# EAGLE design auxboxshield1.6 (EAGLE 6.5.0)
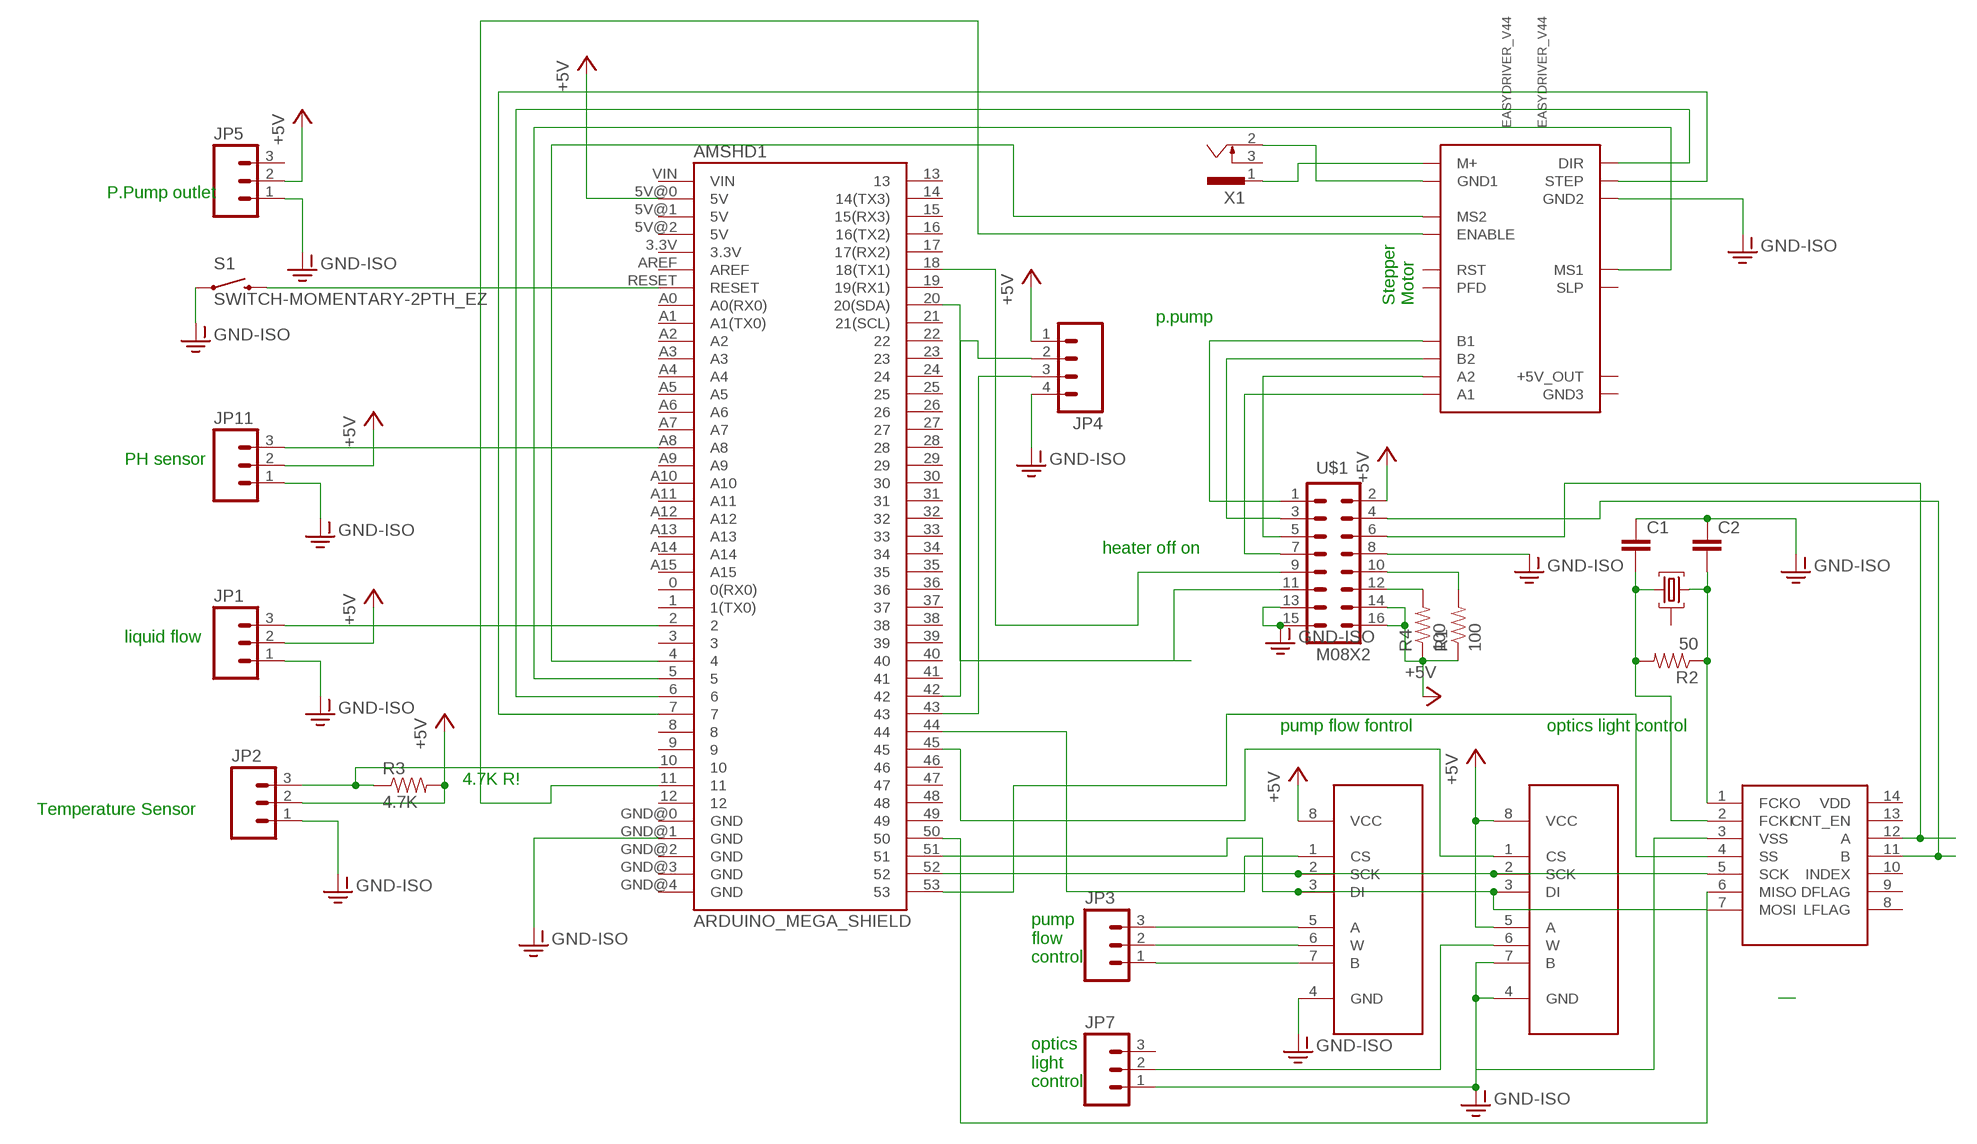
[diagram p0: schematic, sheet 1]

## Parts
AMSHD1  ARDUINO_MEGA_SHIELD  [ARDUINO_MEGA_SHIELD]
C1  0.1UF-50V-20%(PTH)KIT-EZ  [CAP-PTH-SMALL-KIT]
C2  0.1UF-50V-20%(PTH)KIT-EZ  [CAP-PTH-SMALL-KIT]
EASYDRIVER_V44  EASYDRIVER_V44  [EASYDRIVER_V44]
JP1  M03POLAR  [MOLEX-1X3]
JP2  M03POLAR  [MOLEX-1X3]
JP3  M03POLAR  [MOLEX-1X3]
JP4  M04POLAR  [MOLEX-1X4]
JP5  M03POLAR  [MOLEX-1X3]
JP7  M03POLAR  [MOLEX-1X3]
JP11  M03POLAR  [MOLEX-1X3]
QF1  21M30AUM5  [UM5]
R1  100  10OHM-1/4W-5%(PTH)  [AXIAL-0.3]
R2  50  10OHM-1/4W-5%(PTH)  [AXIAL-0.3]
R3  4.7K  10OHM-1/4W-5%(PTH)  [AXIAL-0.3]
R4  100  10OHM-1/4W-5%(PTH)  [AXIAL-0.3]
S1  SWITCH-MOMENTARY-2PTH_EZ  [TACTILE-PTH-EZ]
U1  MCP41XXXDIL  [DIL-08]
U2  MCP41XXXDIL  [DIL-08]
U$1  M08X2  [2X8]
U$2  LS7366R  [SO014]
X1  SCD-014A  [SCD-014-A]

## Nets
+5V: AMSHD1.5V@0(5V) JP1.2 JP2.2 JP4.1 JP5.2 JP11.2 R1.P$1 R3.P$2 R4.P$1 U1.5(A) U1.8(VCC) U2.8(VCC) U$1.14 U$1.16
GND-ISO: AMSHD1.GND@1(GND) C1.1 C2.1 EASYDRIVER_V44.GND2 JP1.1 JP2.1 JP4.4 JP5.1 JP7.1 JP11.1 S1.1 U1.4(GND) U1.7(B) U2.4(GND) U$1.8 U$1.13 U$1.15 U$2.3(VSS)
N$1: EASYDRIVER_V44.M+ X1.1
N$2: AMSHD1.11 EASYDRIVER_V44.ENABLE
N$3: AMSHD1.18(18(TX1)) U$1.9
N$4: R1.P$2 U$1.10
N$5: U$1.4 U$2.11(B)
N$6: EASYDRIVER_V44.GND1 X1.2
N$7: EASYDRIVER_V44.A1 U$1.7
N$8: AMSHD1.43 JP4.3
N$9: AMSHD1.RESET S1.3
N$10: AMSHD1.44 U2.1(CS)
N$11: EASYDRIVER_V44.A2 U$1.5
N$12: C1.2 QF1.1 R2.P$2 U$2.2(FCKI)
N$13: AMSHD1.5 EASYDRIVER_V44.MS1
N$14: AMSHD1.45 U1.1(CS)
N$15: AMSHD1.A8 JP11.3
N$16: AMSHD1.4 EASYDRIVER_V44.MS2
N$17: AMSHD1.52 U1.2(SCK) U2.2(SCK) U$2.5(SCK)
N$18: AMSHD1.20(20(SDA))
N$19: U$1.11
N$20: AMSHD1.51 U1.3(DI) U2.3(DI) U$2.7(MOSI)
N$21: JP3.3 U2.5(A)
N$22: AMSHD1.42 JP4.2
N$24: JP3.2 U2.6(W)
N$25: C2.2 QF1.3 R2.P$1 U$2.1(FCKO)
N$26: AMSHD1.10 JP2.3 R3.P$1
N$27: EASYDRIVER_V44.B2 U$1.3
N$28: AMSHD1.2 JP1.3
N$29: AMSHD1.6 EASYDRIVER_V44.DIR
N$30: AMSHD1.7 EASYDRIVER_V44.STEP
N$31: EASYDRIVER_V44.B1 U$1.1
N$32: JP3.1 U2.7(B)
N$33: R4.P$2 U$1.12
N$34: U$1.6 U$2.12(A)
N$35: JP7.2 U1.6(W)
N$36: AMSHD1.53 U$2.4(SS)
N$37: AMSHD1.50 U$2.6(MISO)
Unconnected: AMSHD1.0(0(RX0)) AMSHD1.1(1(TX0)) AMSHD1.3 AMSHD1.3.3V AMSHD1.5V@1(5V) AMSHD1.5V@2(5V) AMSHD1.8 AMSHD1.9 AMSHD1.12 AMSHD1.13 AMSHD1.14(14(TX3)) AMSHD1.15(15(RX3)) AMSHD1.16(16(TX2)) AMSHD1.17(17(RX2)) AMSHD1.19(19(RX1)) AMSHD1.21(21(SCL)) AMSHD1.22 AMSHD1.23 AMSHD1.24 AMSHD1.25 AMSHD1.26 AMSHD1.27 AMSHD1.28 AMSHD1.29 AMSHD1.30 AMSHD1.31 AMSHD1.32 AMSHD1.33 AMSHD1.34 AMSHD1.35 AMSHD1.36 AMSHD1.37 AMSHD1.38 AMSHD1.39 AMSHD1.40 AMSHD1.41 AMSHD1.46 AMSHD1.47 AMSHD1.48 AMSHD1.49 AMSHD1.A0(A0(RX0)) AMSHD1.A1(A1(TX0)) AMSHD1.A2 AMSHD1.A3 AMSHD1.A4 AMSHD1.A5 AMSHD1.A6 AMSHD1.A7 AMSHD1.A9 AMSHD1.A10 AMSHD1.A11 AMSHD1.A12 AMSHD1.A13 AMSHD1.A14 AMSHD1.A15 AMSHD1.AREF AMSHD1.GND@0(GND) AMSHD1.GND@2(GND) AMSHD1.GND@3(GND) AMSHD1.GND@4(GND) AMSHD1.VIN EASYDRIVER_V44.GND3 EASYDRIVER_V44.P$11(+5V_OUT) EASYDRIVER_V44.PFD EASYDRIVER_V44.RST EASYDRIVER_V44.SLEEP(SLP) JP5.3 JP7.3 QF1.2 U$1.2 U$2.8(LFLAG) U$2.9(DFLAG) U$2.10(INDEX) U$2.13(CNT_EN) U$2.14(VDD) X1.3

## Notes on the sheet
- P.Pump outlet
- Stepper
  Motor
- p.pump
- PH sensor
- heater off on
- liquid flow
- pump flow fontrol | optics light control
- 4.7K R!
- Temperature Sensor
- pump 
  flow
  control
- optics
  light 
  control

## Library data of the parts
AMSHD1 = SparkFun-Boards:ARDUINO_MEGA_SHIELD
C1 C2 = SparkFun-Capacitors:0.1UF-50V-20%(PTH): CAP-08370; PROD_ID: CAP-08370
EASYDRIVER_V44 = EasyDriver:EASYDRIVER_V44: EasyDriver version 4.4 - http://www.schmalzhaus.com/EasyDriver
JP1-JP3 JP5 JP7 JP11 = SparkFun-Connectors:M03: Header 3 Standard 3-pin 0.1" header. Use with straight break away headers (SKU : PRT-00116), right angle break away headers (PRT-00553), swiss pins (PRT-00743), machine pins (PRT-00117), and female headers (PRT-00115). Molex polarized connector foot print use with SKU : PRT-08232 with associated crimp pins and housings.
JP4 = SparkFun-Connectors:M04: Header 4 Standard 4-pin 0.1" header. Use with straight break away headers (SKU : PRT-00116), right angle break away headers (PRT-00553), swiss pins (PRT-00743), machine pins (PRT-00117), and female headers (PRT-00115). Molex polarized connector foot print use with SKU : PRT-08231 with associated crimp pins and housings. 1MM SMD Version SKU: PRT-10208
QF1 = crystal:21M*A: Monolithic Crystal Filters Source: www.vanlong.com; OC_FARNELL: unknown; OC_NEWARK: unknown
R1-R4 = SparkFun-Resistors:10OHM-1/4W-5%(PTH): RES-10698; PROD_ID: RES-10698; VALUE: 10
S1 = SparkFun-Electromechanical:SWITCH-MOMENTARY-2: Various NO switches- pushbuttons, reed, etc
U1 U2 = SparkFun-AnalogIC:MCP41XXX: SPI controlled single digital potentiometer by Microchip PID: COM-10613
U$1 = SparkFun-Connectors:M08X2: .1" headers, two rows of 8 each
U$2 = SparkFun-DigitalIC:LS7366R
X1 = con-shiua-chyuan:SCD-014A: Power Jack 2.5mm; OC_FARNELL: unknown; OC_NEWARK: unknown

## Board
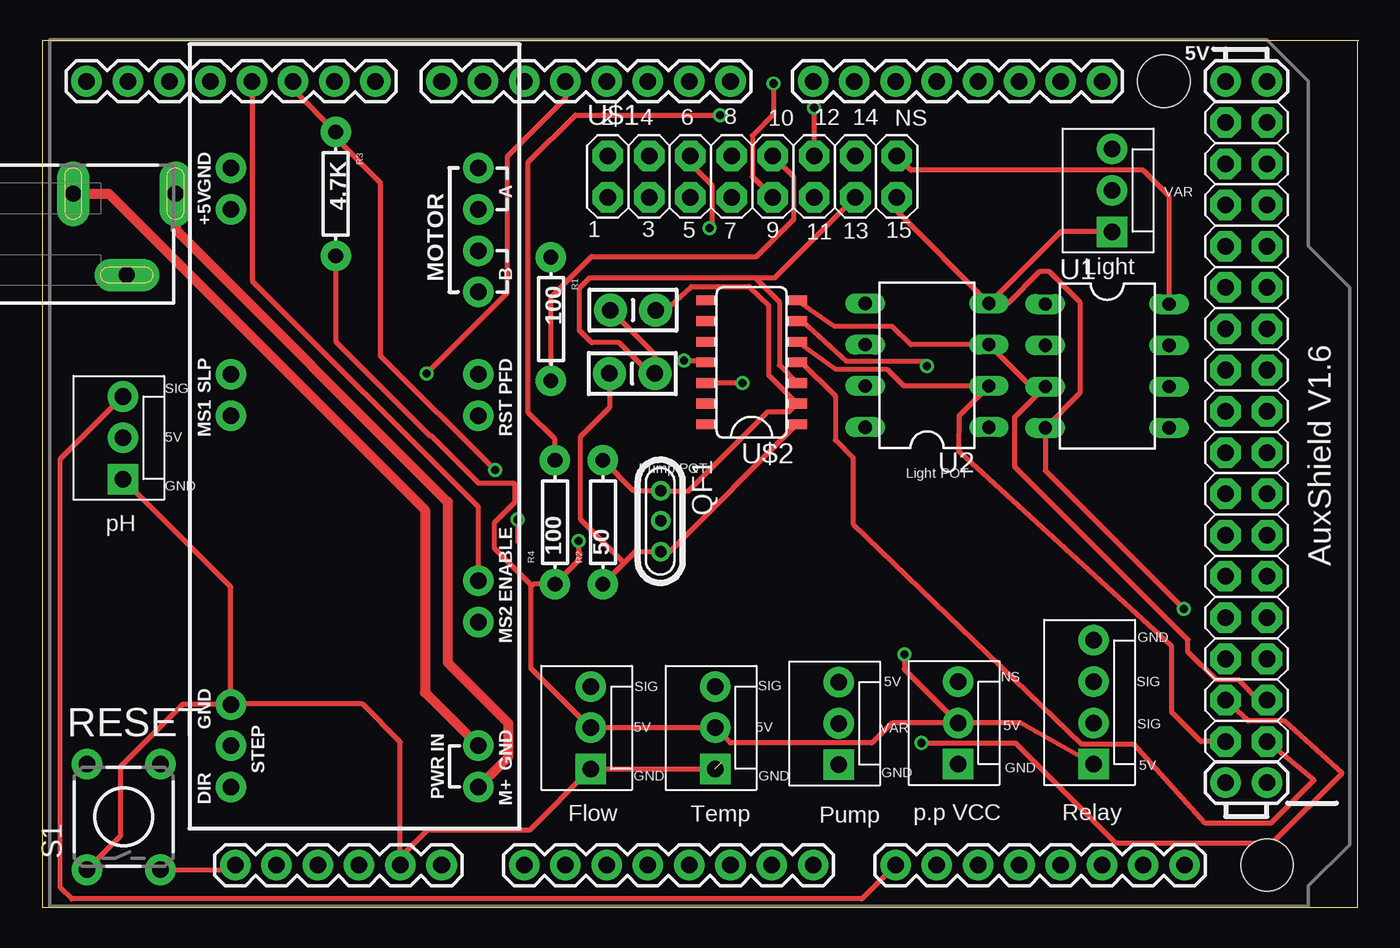
[diagram p1: board, top side]
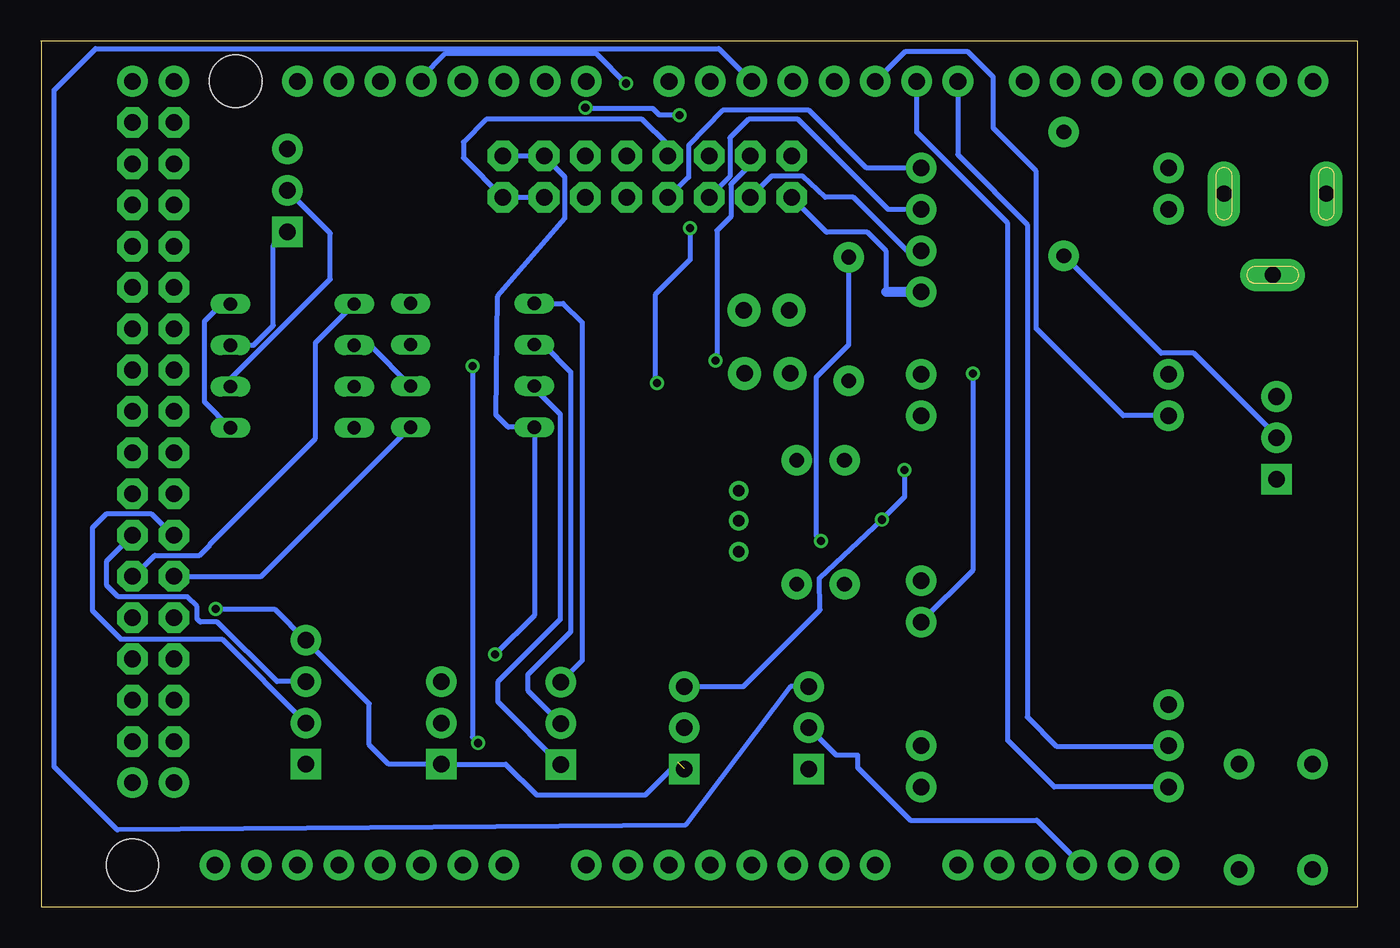
[diagram p2: board, bottom side, seen from below]

Size 81.03 x 53.34 mm. Coordinates in mm from the lower left corner, seen from the top.
Outline: 80.95,53.33 80.95,0 0,0 0,53.33
Outline: 81.03,53.34 0,53.34
Copper layers (1*16): Top 0.0356mm / dielectric 1.5011mm / Bottom 0.0356mm
Design rules "LaenPCBOrder (1)": minimum track width 6mil, minimum drill 13mil, track to track 6mil, track to pad 6mil, pad to pad 6mil, via to via 6mil, smd to smd 6mil, copper to edge 15mil, drill to drill 6mil, minimum pad ring 7mil, minimum via ring 7mil, stop-mask expansion 3mil, vias tented up to drill 0mil, thermal gap 10mil

### Footprints (pad centres in the part's own frame; a part is rotated, then mirrored left to right if it is on the bottom)
ARDUINO_MEGA_SHIELD = drill 1.016 pad 1.88: 0 19.05,27.94; 1 16.51,27.94; 2 13.97,27.94; 3 11.43,27.94; 3.3V -8.89,-20.32; 4 8.89,27.94; 5 6.35,27.94; 5V@0 -6.35,-20.32; 5V@1 49.53,27.94; 5V@2 52.07,27.94; 6 3.81,27.94; 7 1.27,27.94; 8 -2.794,27.94; 9 -5.334,27.94; 10 -7.874,27.94; 11 -10.414,27.94; 12 -12.954,27.94; 13 -15.494,27.94; 14 24.13,27.94; 15 26.67,27.94; 16 29.21,27.94; 17 31.75,27.94; 18 34.29,27.94; 19 36.83,27.94; 20 39.37,27.94; 21 41.91,27.94; A0 6.35,-20.32; A1 8.89,-20.32; A2 11.43,-20.32; A3 13.97,-20.32; A4 16.51,-20.32; A5 19.05,-20.32; A6 21.59,-20.32; A7 24.13,-20.32; A8 29.21,-20.32; A9 31.75,-20.32; A10 34.29,-20.32; A11 36.83,-20.32; A12 39.37,-20.32; A13 41.91,-20.32; A14 44.45,-20.32; A15 46.99,-20.32; AREF -20.574,27.94; GND@0 -3.81,-20.32; GND@1 -1.27,-20.32; GND@2 49.53,-15.24; GND@3 52.07,-15.24; GND@4 -18.034,27.94; RESET -11.43,-20.32; VIN 1.27,-20.32 | drill 1.016 pad 1.88 octagon: 22 49.53,25.4; 23 52.07,25.4; 24 49.53,22.86; 25 52.07,22.86; 26 49.53,20.32; 27 52.07,20.32; 28 49.53,17.78; 29 52.07,17.78; 30 49.53,15.24; 31 52.07,15.24; 32 49.53,12.7; 33 52.07,12.7; 34 49.53,10.16; 35 52.07,10.16; 36 49.53,7.62; 37 52.07,7.62; 38 49.53,5.08; 39 52.07,5.08; 40 49.53,2.54; 41 52.07,2.54; 42 49.53,0; 43 52.07,0; 44 49.53,-2.54; 45 52.07,-2.54; 46 49.53,-5.08; 47 52.07,-5.08; 48 49.53,-7.62; 49 52.07,-7.62; 50 49.53,-10.16; 51 52.07,-10.16; 52 49.53,-12.7; 53 52.07,-12.7 | hole 3.2: 45.72,27.94; 52.07,-20.32
CAP-PTH-SMALL-KIT = drill 1.016 pad 2.032: 1 -1.397,0; 2 1.397,0
EASYDRIVER_V44 = drill 1.016 pad 1.88: A1 -16.51,7.62; A2 -13.97,7.62; B1 -8.89,7.62; B2 -11.43,7.62; DIR 21.59,-7.62; ENABLE 8.89,7.62; GND1 19.05,7.62; GND2 16.51,-7.62; GND3 -16.51,-7.62; M+ 21.59,7.62; MS1 -1.27,-7.62; MS2 11.43,7.62; P$11 -13.97,-7.62; PFD -3.81,7.62; RST -1.27,7.62; SLEEP -3.81,-7.62; STEP 19.05,-7.62
MOLEX-1X3 = drill 1.016 pad 1.88 square: 1 0,0 | drill 1.016 pad 1.88: 2 2.54,0; 3 5.08,0
MOLEX-1X4 = drill 1.016 pad 1.88 square: 1 0,0 | drill 1.016 pad 1.88: 2 2.54,0; 3 5.08,0; 4 7.62,0
UM5 = drill 0.7 pad 1.2: 1 -1.875,0; 2 -0.027,0; 3 1.875,0
AXIAL-0.3 = drill 0.9 pad 1.88: P$1 -3.81,0; P$2 3.81,0
TACTILE-PTH-EZ = drill 1.016 pad 1.88: 1 -3.251,2.261; 2 3.251,2.261; 3 -3.251,-2.261; 4 3.251,-2.261
DIL-08 = drill 0.813 long: 1 -3.81,-3.81; 2 -1.27,-3.81; 3 1.27,-3.81; 4 3.81,-3.81; 5 3.81,3.81; 6 1.27,3.81; 7 -1.27,3.81; 8 -3.81,3.81
2X8 = drill 1.016 pad 1.88 octagon: 1 0,0; 2 0,2.54; 3 2.54,0; 4 2.54,2.54; 5 5.08,0; 6 5.08,2.54; 7 7.62,0; 8 7.62,2.54; 9 10.16,0; 10 10.16,2.54; 11 12.7,0; 12 12.7,2.54; 13 15.24,0; 14 15.24,2.54; 15 17.78,0; 16 17.78,2.54
SO014 = smd 0.6 x 1.2: 1 -3.175,-2.8; 2 -1.905,-2.8; 3 -0.635,-2.8; 4 0.635,-2.8; 5 1.905,-2.8; 6 3.175,-2.8; 7 4.445,-2.8; 8 4.445,2.8; 9 3.175,2.8; 10 1.905,2.8; 11 0.635,2.8; 12 -0.635,2.8; 13 -1.905,2.8; 14 -3.175,2.8
SCD-014-A = drill 1 pad 2 long: 1 -2.5,13.8; 2 -2.5,7.5; 3 2.5,10.8

### Placement (x,y rotation side)
AMSHD1  23.3,22.9 0 top
C1  36.35,36.75 0 top
C2  36.3,32.85 180 top
EASYDRIVER_V44  19.21,28.98 270 top
JP1  33.75,8.5 90 top
JP2  41.4,8.5 90 top
JP3  49.01,8.77 90 top
JP4  64.7,8.8 90 top
JP5  56.35,8.8 90 top
JP7  65.84,41.58 90 top
JP11  4.95,26.35 90 top
QF1  38.05,23.75 270 top
R1  31.3,36.2 270 top
R2  34.5,23.7 90 top
R3  18.05,43.9 270 top
R4  31.55,23.7 90 top
S1  5,5.55 90 top
U1  65.53,33.31 270 top
U2  54.45,33.35 90 top
U$1  34.8,43.7 0 top
U$2  43.65,32.9 90 top
X1  -5.61,41.42 270 top

### Tracks (layer width: path | path; a pad name or v marks a point on that pad's centre or on a via)
+5V  (via drill 0.5 pad 0.25)
  Top 0.305: R3.P$2 18.05,34.8 23.85,29 23.95,29 26.85,26.1 29.05,26.1 29.05,24.9 27.8,23.65 27.8,22.1 30.05,19.85 30.05,19.7 | 30.05,19.7 30.05,14.74 JP1.2 JP2.2 42.34,10.1 51.05,10.1 52.29,11.34 JP5.2 | JP4.1 60.19,11.35 JP5.2 | 30.05,19.7 30.24,19.89 R4.P$1 33,21.34 v33,22.55 | v53.05,15.55 53.05,14.64 JP5.2 | U1.8 69.34,43.76 67.75,45.35 53.47,45.35 U$1.16
  Bottom 0.305: AMSHD1.5V@0 19.72,5.35 27.5,5.35 30.75,8.6 30.75,9.35 32.06,9.35 JP1.2 | JP11.2 4.95,29 10.05,34.1 12.06,34.1 R3.P$2 | U1.8 69.88,37.12 70.95,36.05 70.95,31.11 U1.5 | U$1.16 U$1.14 48.75,44.95 48.75,42.4 52.9,37.6 53,30.3 52.24,29.54 U2.8 50.64,17.96 v53.05,15.55 | R1.P$1 31.3,34.6 33.3,32.6 33.3,22.85 v33,22.55
GND-ISO  (via drill 0.5 pad 0.25)  (1 unrouted)
  Top 0.305: EASYDRIVER_V44.GND2 11.62,12.5 19.7,12.5 22.03,10.17 AMSHD1.GND@1 22.03,3.08 23.7,4.75 30,4.75 JP1.1 JP2.1 | EASYDRIVER_V44.GND2 11.59,19.71 JP11.1 | EASYDRIVER_V44.GND2 8.62,12.47 4.8,8.65 4.8,4.36 S1.1 | JP7.1 62.67,41.58 U2.4 | U$1.15 52.58,42.84 U2.4 | U2.4 59.41,37.16 61.4,39.15 61.95,39.15 63.85,37.25 63.85,31.63 U1.4 61.73,26.88 v70.25,18.35 | C1.1 37.7,34.01 C2.1 37.4,32.85 35.5,34.75 33.8,34.75 33.05,35.5 33.05,38.1 33.7,38.75 43.85,38.75 | 43.85,38.75 45.35,37.25 45.35,33.37 U$2.3 | 43.85,38.75 45.09,38.75 U$1.13
  Bottom 0.305: U1.7 67.92,34.59 66.7,35.8 66.7,40.72 JP7.1 | 41.8,8.9 43.8,6.9 50.5,6.9 52.4,8.8 JP5.1 59.6,8.8 60.8,10 60.8,12.52 JP4.4 66.63,18.35 v70.25,18.35 | U$1.8 42.42,46.92 44,48.5 53.6,48.5 55,47.1 55,46.12 U$1.15 U$1.13
N$1
  Top 0.61: X1.1 8.19,41.71 24.95,24.95 24.95,15.05 28.65,11.35 28.65,9.21 EASYDRIVER_V44.M+
N$2
  Top 0.305: EASYDRIVER_V44.ENABLE 26.83,24.62 12.95,38.5 12.95,50.78 AMSHD1.11
N$3  (via drill 0.5 pad 0.25)
  Top 0.305: v45,50.7 45,48.8 43.7,47.5 43.7,44.96 U$1.9
  Bottom 0.305: AMSHD1.18 57.59,51.06 56.1,52.55 46.85,52.55 v45,50.7
N$4
  Top 0.305: R1.P$2 31.3,37.55 33.8,40.05 43.95,40.05 46.25,42.35 46.25,44.95 U$1.10
N$5  (via drill 0.5 pad 0.25)
  Top 0.305: v39.5,33.65 40.73,33.65 U$2.11
  Bottom 0.305: U$1.4 37.34,45.71 38.55,44.5 38.55,42.5 39.4,41.65 39.4,33.75 v39.5,33.65
N$6
  Top 0.61: X1.2 4.08,43.92 23.55,24.45 23.55,13.21 EASYDRIVER_V44.GND1
N$7
  Bottom 0.305: EASYDRIVER_V44.A1 30.19,45.49 33.75,49.05 39.05,49.05 41.15,46.9 41.15,44.92 U$1.7
N$8
  Bottom 0.305: JP4.3 66.48,13.88 70.15,17.55 71.2,17.55 71.4,17.75 71.4,18.5 72,19.1 76.25,19.1 76.95,19.8 76.95,21.32 AMSHD1.43
N$9
  Top 0.305: S1.3 11.59,2.3 AMSHD1.RESET
N$10
  Bottom 0.305: AMSHD1.44 67.44,20.36 U2.1
N$11
  Bottom 0.305: EASYDRIVER_V44.A2 28.85,42.95 34.4,48.5 37.45,48.5 38.6,47.35 38.6,44.98 U$1.5
N$12
  Top 0.305: R2.P$2 36.38,25.62 QF1.1 39.77,25.62 44.65,30.5 45.95,30.5 U$2.2 44.7,32.74 44.7,37.05 43.5,38.2 39.95,38.2 38.35,36.75 C1.2
N$13
  Bottom 0.305: EASYDRIVER_V44.MS1 14.4,30.25 19.75,35.6 19.75,45.3 22.4,47.95 22.4,51.1 23.95,52.65 27.84,52.65 AMSHD1.5
N$14
  Bottom 0.305: AMSHD1.45 75.29,20.36 74,21.65 71.25,21.65 70.6,22.3 70.6,22.35 64.1,28.85 64.1,34.75 U1.1
N$15
  Top 0.305: JP11.3 1.1,27.58 1.1,1.2 1.8,0.5 50.43,0.5 AMSHD1.A8
N$16  (via drill 0.5 pad 0.25)
  Top 0.305: AMSHD1.4 32.19,49.79 28.6,46.2 28.6,37.8 v23.65,32.85
  Bottom 0.305: v23.65,32.85 23.65,20.73 EASYDRIVER_V44.MS2
N$17
  Top 0.305: AMSHD1.52 71.3,10.2 69.5,12 69.5,16.05 56.4,28.05 56.42,30.25 U2.2 53.02,32.08 52,33.1 48.85,33.1 U$2.5
  Bottom 0.305: U1.2 60.76,34.59 U2.2
N$20
  Top 0.305: AMSHD1.51 74.86,12.74 73.65,14 72.25,14 70.5,15.7 70.5,16.45 59.85,27.1 59.85,30.17 U1.3 60.84,32.05 U2.3 53.43,34.62 52.3,35.75 48.74,35.75 U$2.7
N$21
  Bottom 0.305: U2.5 48.86,37.16 47.7,36 47.7,15.16 JP3.3
N$22
  Bottom 0.305: AMSHD1.42 72.9,22.9 74.2,24.2 77,24.2 77.85,23.35 77.85,18.25 76.1,16.5 69.86,16.5 JP4.2
N$24
  Bottom 0.305: U2.6 50.07,34.62 48.4,32.95 48.4,16.95 51.05,14.3 51.05,13.35 JP3.2
N$25
  Top 0.305: 35.8,21.2 36.48,21.88 QF1.3 38.6,21.88 U$2.1 | 35.8,21.2 R2.P$1 | C2.2 34.9,30.75 33.1,28.95 33.1,23.9 35.8,21.2
N$26  (via drill 0.5 pad 0.25)
  Top 0.305: AMSHD1.10 15.43,50.33 R3.P$1 18.05,47.35 20.8,44.6 20.8,33.95 v27.85,26.9 | v29.25,23.85 29.25,22.5
  Bottom 0.305: v27.85,26.9 27.85,25.25 v29.25,23.85 33.1,20.25 33.05,18.3 37.77,13.58 JP2.3
N$27
  Bottom 0.305: EASYDRIVER_V44.B2 27.71,40.41 31,43.7 32.75,43.7 34.15,45 36.04,45 U$1.3
N$28
  Bottom 0.305: JP1.3 34.87,13.58 41.35,5.05 76.3,4.75 80.2,8.65 80.2,50.3 77.65,52.85 39.28,52.85 AMSHD1.2
N$29
  Bottom 0.305: EASYDRIVER_V44.DIR 18.64,7.39 21.5,10.25 21.5,42.1 27.1,47.7 AMSHD1.6
N$30
  Bottom 0.305: AMSHD1.7 24.57,46.32 22.3,44.05 22.3,44 20.3,42 20.3,11.7 18.5,9.9 11.62,9.9 EASYDRIVER_V44.STEP
N$31
  Bottom 0.305: 28.97,37.87 28.97,40.37 30.15,41.55 32.65,41.55 U$1.1
  Bottom 0.61: EASYDRIVER_V44.B1 28.97,37.87
N$32
  Bottom 0.305: U2.7 50.64,31.94 49.05,30.35 49.05,17.7 52.9,13.85 52.9,12.66 JP3.1
N$33  (via drill 0.5 pad 0.25)
  Top 0.305: R4.P$2 31.55,28.8 29.9,30.45 29.9,45.85 32.8,48.75 v41.7,48.75 | v47.5,49.2 U$1.12
  Bottom 0.305: v41.7,48.75 42.95,48.75 43.35,49.15 47.45,49.15 v47.5,49.2
N$34  (via drill 0.5 pad 0.25)
  Top 0.305: U$1.6 39.88,45.77 41.2,44.45 41.2,41.95 v41.05,41.8 | v43.1,32.25 40.87,32.25 U$2.12
  Bottom 0.305: v41.05,41.8 41.05,39.85 43.2,37.7 43.2,32.35 v43.1,32.25
N$35
  Bottom 0.305: U1.6 69.34,32.51 63.2,38.65 63.2,41.48 JP7.2
N$36
  Top 0.305: U$2.4 46.72,33.53 48.8,31.45 48.8,28.75 49.9,27.65 49.9,23.6 63.95,10.05 67.15,10.05 71.5,5.2 75.65,5.2 78.25,7.8 78.27,7.8 AMSHD1.53
N$37  (via drill 0.5 pad 0.25)
  Top 0.305: U$2.6 46.77,36.08 49.5,33.6 54.4,33.6 v54.45,33.3 | v54.1,10.1 59.9,10.1 66.05,3.95 75.7,3.95 80,8.25 76.45,11.45 74.22,11.45 AMSHD1.50
  Bottom 0.305: v54.45,33.3 54.45,10.45 v54.1,10.1

### Text on the board
tPlace: 2 | 4 | 6 | 8 | 10 | 12 | 14 | NS | VAR | 1 | 3 | 5 | 7 | 9 | 11 | 13 | 15 | Light | SIG | 5V | Pump POT | GND | Light POT | pH | AuxShield V1.6 | GND | 5V | NS | SIG | SIG | SIG | 5V | 5V | VAR | 5V | SIG | RESET | GND | GND | GND | GND | 5V | Flow | Temp | Pump | p.p VCC | Relay
DrillLegend_01-16: 01-16